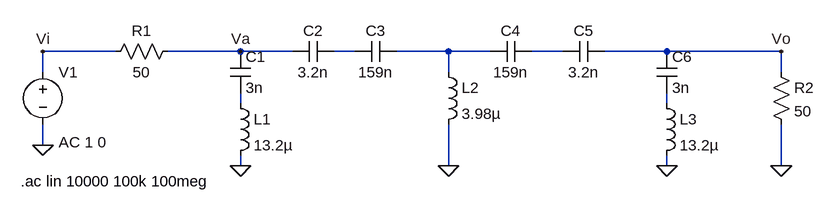
[diagram p0: schematic ej1-norm.asc]
ej1-norm.asc, the LTspice schematic file:
Version 4
SHEET 1 880 680
WIRE -400 -176 -512 -176
WIRE -208 -176 -320 -176
WIRE -128 -176 -208 -176
WIRE -32 -176 -64 -176
WIRE 112 -176 32 -176
WIRE 176 -176 112 -176
WIRE 288 -176 240 -176
WIRE 448 -176 352 -176
WIRE 624 -176 448 -176
WIRE -512 -144 -512 -176
WIRE 112 -144 112 -176
WIRE 624 -144 624 -176
WIRE -208 -96 -208 -112
WIRE 448 -96 448 -112
WIRE -512 -32 -512 -64
WIRE -208 0 -208 -16
WIRE 112 0 112 -64
WIRE 448 0 448 -16
WIRE 624 0 624 -64
FLAG -512 -32 0
FLAG -208 0 0
FLAG 112 0 0
FLAG 448 0 0
FLAG 624 0 0
FLAG -512 -176 Vi
FLAG -208 -176 Va
FLAG 624 -176 Vo
SYMBOL voltage -512 -160 R0
WINDOW 123 24 124 Left 2
WINDOW 39 0 0 Left 0
SYMATTR Value2 AC 1 0
SYMATTR InstName V1
SYMATTR Value ""
SYMBOL res -304 -192 R90
WINDOW 0 0 56 VBottom 2
WINDOW 3 32 56 VTop 2
SYMATTR InstName R1
SYMATTR Value 50
SYMBOL cap -224 -176 R0
SYMATTR InstName C1
SYMATTR Value 3n
SYMBOL ind -224 -112 R0
SYMATTR InstName L1
SYMATTR Value 13.2µ
SYMBOL cap -64 -192 R90
WINDOW 0 0 32 VBottom 2
WINDOW 3 32 32 VTop 2
SYMATTR InstName C2
SYMATTR Value 3.2n
SYMBOL cap 32 -192 R90
WINDOW 0 0 32 VBottom 2
WINDOW 3 32 32 VTop 2
SYMATTR InstName C3
SYMATTR Value 159n
SYMBOL ind 96 -160 R0
SYMATTR InstName L2
SYMATTR Value 3.98µ
SYMBOL cap 240 -192 R90
WINDOW 0 0 32 VBottom 2
WINDOW 3 32 32 VTop 2
SYMATTR InstName C4
SYMATTR Value 159n
SYMBOL cap 352 -192 R90
WINDOW 0 0 32 VBottom 2
WINDOW 3 32 32 VTop 2
SYMATTR InstName C5
SYMATTR Value 3.2n
SYMBOL cap 432 -176 R0
SYMATTR InstName C6
SYMATTR Value 3n
SYMBOL ind 432 -112 R0
SYMATTR InstName L3
SYMATTR Value 13.2µ
SYMBOL res 608 -160 R0
SYMATTR InstName R2
SYMATTR Value 50
TEXT -546 24 Left 2 !.ac lin 10000 100k 100meg

The netlist it stands for:
* ej1-norm.asc
V1 Vi 0 AC 1 0
R1 Va Vi 50
C1 Va N004 3n
L1 N004 0 13.2µ
C2 N001 Va 3.2n
C3 N002 N001 159n
L2 N002 0 3.98µ
C4 N003 N002 159n
C5 Vo N003 3.2n
C6 Vo N005 3n
L3 N005 0 13.2µ
R2 Vo 0 50
.ac lin 10000 100k 100meg
.backanno
.end